# Altium project SCHEME1.PrjPcb
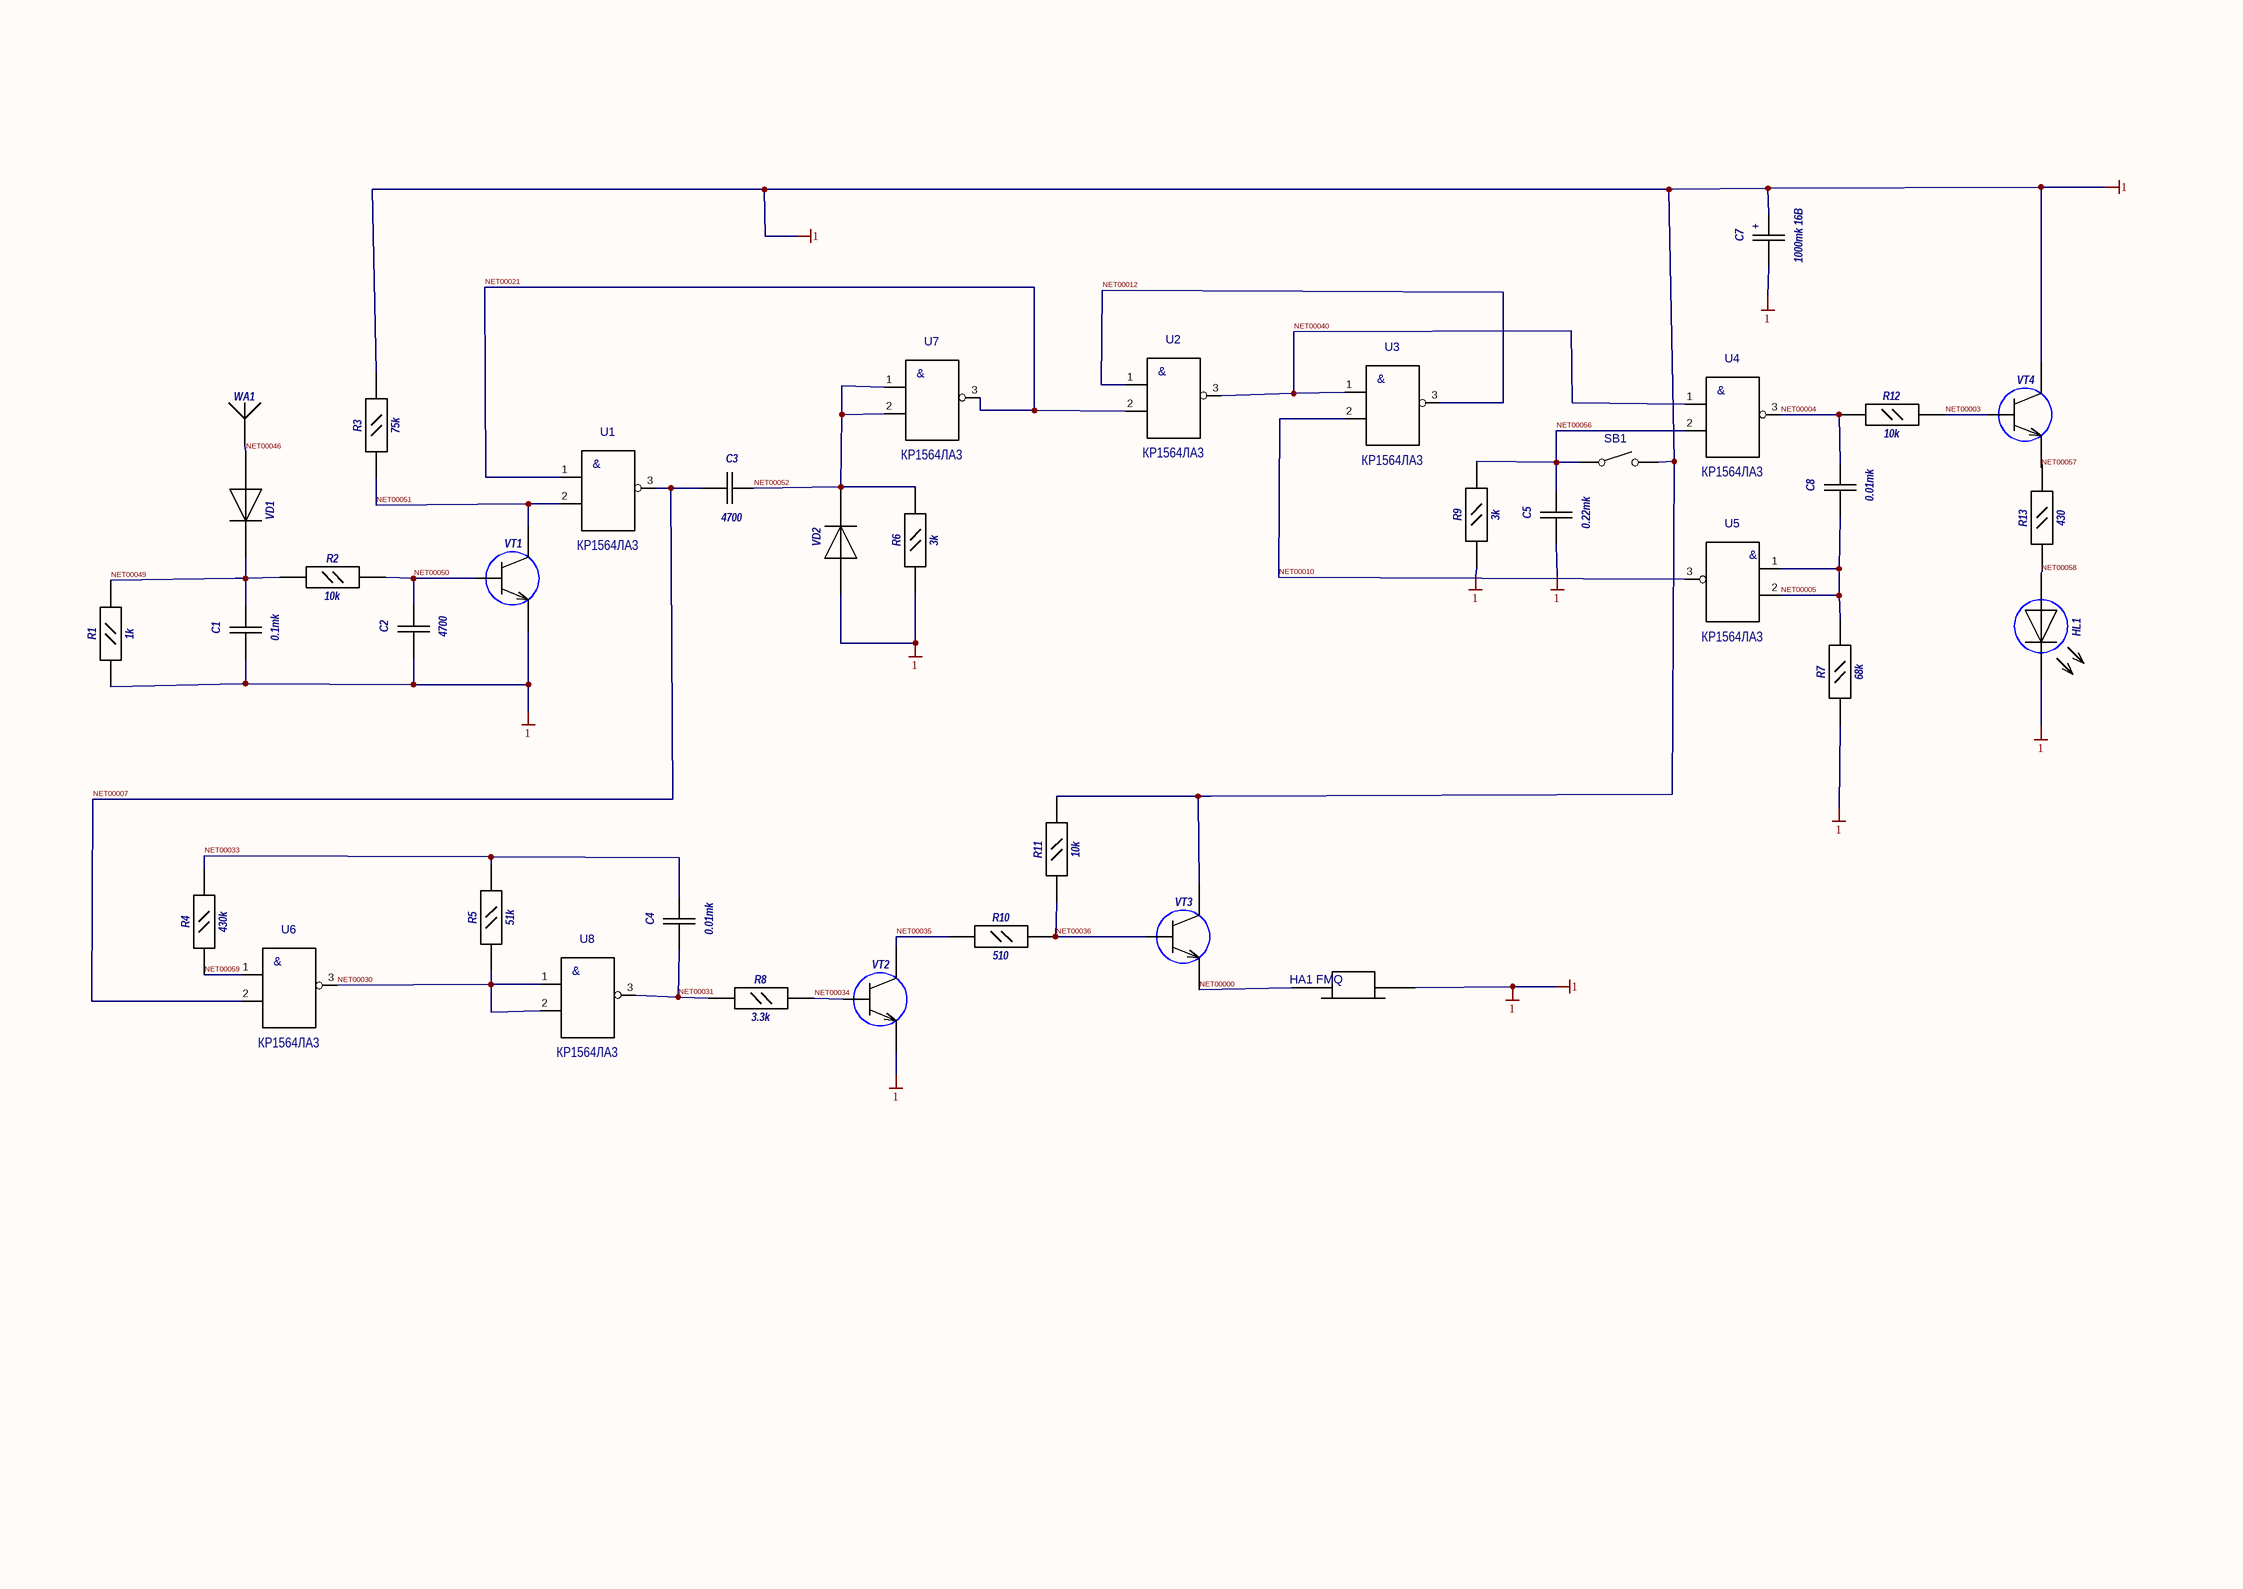
[diagram p0: Sheet1.SCHDOC]
1 sheet, 38 parts. Net scope: global (net labels, ports and power ports of the same name join across sheets).

## Sheet Sheet1.SCHDOC
size 420 x 297 mm; SheetNumber: 1; SheetTotal: 1; DocumentName: Sheet1.SCHDOC

### Parts
1  value HA1 FMQ  [ЗП-3]  (hidden comment: ZP-3)
C1  value 0.1mk  [K71-6 (10X4)]  (hidden comment: K71-6 (5-30 МК))
C2  value 4700  [K71-6 (10X4)]  (hidden comment: K71-6 (5-30 МК))
C3  value 4700  [K71-6 (10X4)]  (hidden comment: K71-6 (5-30 МК))
C4  value 0.01mk  [K71-6 (10X4)]  (hidden comment: K71-6 (5-30 МК))
C5  value 0.22mk  [K71-6 (10X4)]  (hidden comment: K71-6 (5-30 МК))
C7  value 1000mk 16B  [К50-29 (17Х6)]  (hidden comment: K50-29 (1;2,2;4,7;10;22 MK))
C8  value 0.01mk  [K71-6 (10X4)]  (hidden comment: K71-6 (5-30 МК))
HL1  АЛ307  [АЛ307]  (value not drawn)
R1  value 1k  [МЛТ(0.125)]  (hidden comment: МЛТ(0.125))
R2  value 10k  [МЛТ(0.125)]  (hidden comment: МЛТ(0.125))
R3  value 75k  [МЛТ(0.125)]  (hidden comment: МЛТ(0.125))
R4  value 430k  [МЛТ(0.125)]  (hidden comment: МЛТ(0.125))
R5  value 51k  [МЛТ(0.125)]  (hidden comment: МЛТ(0.125))
R6  value 3k  [МЛТ(0.125)]  (hidden comment: МЛТ(0.125))
R7  value 68k  [МЛТ(0.125)]  (hidden comment: МЛТ(0.125))
R8  value 3.3k  [МЛТ(0.125)]  (hidden comment: МЛТ(0.125))
R9  value 3k  [МЛТ(0.125)]  (hidden comment: МЛТ(0.125))
R10  value 510  [МЛТ(0.125)]  (hidden comment: МЛТ(0.125))
R11  value 10k  [МЛТ(0.125)]  (hidden comment: МЛТ(0.125))
R12  value 10k  [МЛТ(0.125)]  (hidden comment: МЛТ(0.125))
R13  value 430  [МЛТ(0.125)]  (hidden comment: МЛТ(0.125))
SB1  TURN  [TRN]  (value not drawn)
U1  КР1564ЛА3
U2  КР1564ЛА3
U3  КР1564ЛА3
U4  КР1564ЛА3
U5  КР1564ЛА3
U6  КР1564ЛА3
U7  КР1564ЛА3
U8  КР1564ЛА3
VD1  КД213А  [КД213]  (value not drawn)
VD2  КД213А  [КД213]  (value not drawn)
VT1  KT315  [КT315]  (value not drawn)
VT2  KT315  [КT315]  (value not drawn)
VT3  KT315  [КT315]  (value not drawn)
VT4  KT315  [КT315]  (value not drawn)
WA1  АНТЕННА(НЕСИММЕТРИЧНАЯ)  [АНТЕННА]  (value not drawn)

### Nets
1: 1.1 C1.1 C2.1 C5.1 C7.1 C7.2 HL1.2 R1.2 R3.2 R6.1 R7.1 R9.1 R11.2 SB1.2 VD2.1 VT1.3 VT2.3 VT3.2 VT4.2
NET00000: 1.2 VT3.3
NET00003: R12.2 VT4.1
NET00004: C8.2 R12.1 U4.3
NET00005: C8.1 R7.2 U5.1 U5.2
NET00007: C3.1 U1.3 U6.2
NET00010: U3.2 U5.3
NET00012: U2.1 U3.3
NET00021: U1.1 U2.2 U7.3
NET00030: R5.1 U6.3 U8.1 U8.2
NET00031: C4.1 R8.1 U8.3
NET00033: C4.2 R4.2 R5.2
NET00034: R8.2 VT2.1
NET00035: R10.1 VT2.2
NET00036: R10.2 R11.1 VT3.1
NET00040: U2.3 U3.1 U4.1
NET00046: VD1.1 WA1.1
NET00049: C1.2 R1.1 R2.1 VD1.2
NET00050: C2.2 R2.2 VT1.1
NET00051: R3.1 U1.2 VT1.2
NET00052: C3.2 R6.2 U7.1 U7.2 VD2.2
NET00056: C5.2 R9.2 SB1.1 U4.2
NET00057: R13.2 VT4.3
NET00058: HL1.1 R13.1
NET00059: R4.1 U6.1

### Notes on the sheet
- (in symbol K50-29 (1;2,2;4,7;10;22 MK)) +
- (in symbol КР1564ЛА3) &

### Library data of the parts
SB1 = TURN: Value: *
U1-U8 = КР1564ЛА3: Value: *